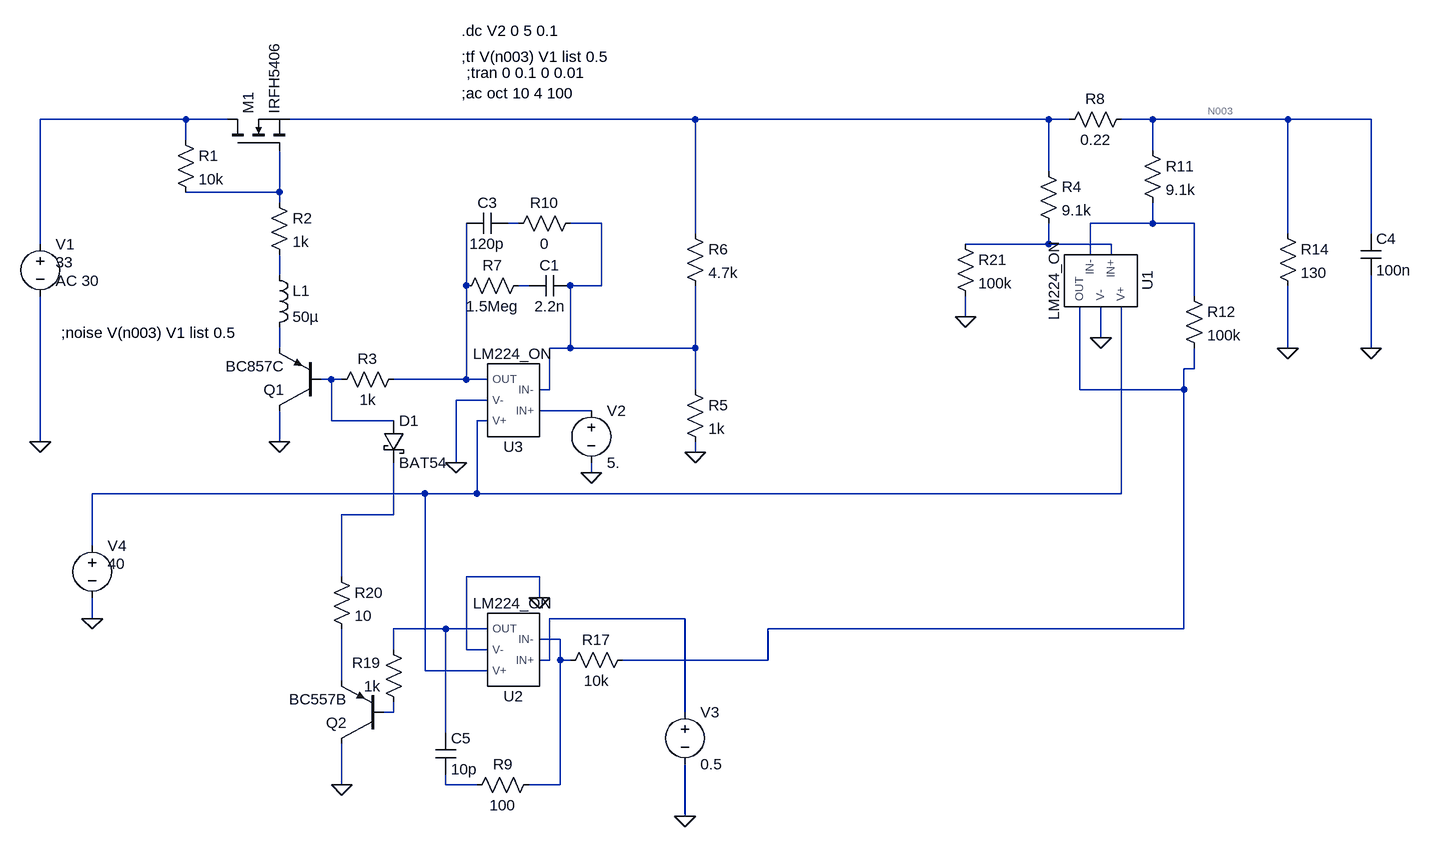
[diagram p0: schematic power_ac3.asc]
power_ac3.asc, the LTspice schematic file:
Version 4
SHEET 1 1520 1352
WIRE -608 96 -832 96
WIRE -544 96 -608 96
WIRE 176 96 -448 96
WIRE 720 96 176 96
WIRE 752 96 720 96
WIRE 880 96 832 96
WIRE 1088 96 880 96
WIRE 1216 96 1088 96
WIRE -608 128 -608 96
WIRE 880 144 880 96
WIRE 720 176 720 96
WIRE -464 208 -464 144
WIRE -464 208 -608 208
WIRE -464 224 -464 208
WIRE -96 256 -112 256
WIRE 32 256 -16 256
WIRE 880 256 880 224
WIRE 880 256 784 256
WIRE 944 256 880 256
WIRE 176 272 176 96
WIRE 1088 272 1088 96
WIRE 1216 272 1216 96
WIRE -832 288 -832 96
WIRE 720 288 720 256
WIRE 720 288 592 288
WIRE 816 288 720 288
WIRE 784 304 784 256
WIRE 816 304 816 288
WIRE -464 336 -464 304
WIRE -176 352 -176 256
WIRE -80 352 -96 352
WIRE 32 352 32 256
WIRE 32 352 -16 352
WIRE 944 368 944 256
WIRE 592 400 592 368
WIRE 800 432 800 384
WIRE -464 448 -464 416
WIRE -16 448 -16 352
WIRE -16 448 -48 448
WIRE 176 448 176 352
WIRE 176 448 -16 448
WIRE 1088 448 1088 352
WIRE 1216 448 1216 336
WIRE 944 480 944 448
WIRE 944 480 928 480
WIRE -384 496 -400 496
WIRE -368 496 -384 496
WIRE -176 496 -176 352
WIRE -176 496 -288 496
WIRE -144 496 -176 496
WIRE -48 512 -48 448
WIRE -48 512 -64 512
WIRE 176 512 176 448
WIRE 768 512 768 384
WIRE 928 512 928 480
WIRE 928 512 768 512
WIRE -144 528 -192 528
WIRE 16 544 -64 544
WIRE -384 560 -384 496
WIRE -288 560 -384 560
WIRE -144 560 -160 560
WIRE -832 592 -832 368
WIRE -464 592 -464 544
WIRE 176 608 176 592
WIRE -192 624 -192 528
WIRE 16 640 16 624
WIRE -240 672 -752 672
WIRE -160 672 -160 560
WIRE -160 672 -240 672
WIRE 832 672 832 384
WIRE 832 672 -160 672
WIRE -288 704 -288 624
WIRE -288 704 -368 704
WIRE -752 752 -752 672
WIRE -368 800 -368 704
WIRE -64 800 -176 800
WIRE -64 832 -64 800
WIRE -752 864 -752 832
WIRE 160 864 -48 864
WIRE -208 880 -288 880
WIRE -144 880 -208 880
WIRE 928 880 928 512
WIRE 928 880 288 880
WIRE -32 896 -64 896
WIRE -288 912 -288 880
WIRE -176 912 -176 800
WIRE -144 912 -176 912
WIRE -48 928 -48 864
WIRE -48 928 -64 928
WIRE -32 928 -32 896
WIRE -16 928 -32 928
WIRE 288 928 288 880
WIRE 288 928 64 928
WIRE -240 944 -240 672
WIRE -144 944 -240 944
WIRE -368 960 -368 880
WIRE -288 1008 -288 992
WIRE -288 1008 -304 1008
WIRE 160 1008 160 864
WIRE -208 1040 -208 880
WIRE -368 1120 -368 1056
WIRE -208 1120 -208 1104
WIRE -160 1120 -208 1120
WIRE -32 1120 -32 928
WIRE -32 1120 -80 1120
WIRE 160 1168 160 1088
FLAG -464 592 0
FLAG -832 592 0
FLAG 16 640 0
FLAG -192 624 0
FLAG 176 608 0
FLAG 1088 448 0
FLAG 160 1168 0
FLAG -64 832 0
FLAG -368 1120 0
FLAG 592 400 0
FLAG 1216 448 0
FLAG -752 864 0
FLAG 800 432 0
SYMBOL res -624 112 R0
SYMATTR InstName R1
SYMATTR Value 10k
SYMBOL res -480 208 R0
SYMATTR InstName R2
SYMATTR Value 1k
SYMBOL pnp -400 544 R180
SYMATTR InstName Q1
SYMATTR Value BC857C
SYMBOL res -272 480 R90
WINDOW 0 0 56 VBottom 2
WINDOW 3 32 56 VTop 2
SYMATTR InstName R3
SYMATTR Value 1k
SYMBOL voltage -832 272 R0
WINDOW 123 24 72 Left 2
WINDOW 39 0 0 Left 2
WINDOW 3 24 44 Left 2
SYMATTR Value2 AC 30
SYMATTR Value 33
SYMATTR InstName V1
SYMBOL voltage 16 528 R0
WINDOW 123 24 124 Left 2
WINDOW 39 0 0 Left 2
SYMATTR InstName V2
SYMATTR Value 5.
SYMBOL nmos -544 144 R270
SYMATTR InstName M1
SYMATTR Value IRFH5406
SYMBOL res 160 496 R0
SYMATTR InstName R5
SYMATTR Value 1k
SYMBOL res 160 256 R0
SYMATTR InstName R6
SYMATTR Value 4.7k
SYMBOL res -80 336 R90
WINDOW 0 0 56 VBottom 2
WINDOW 3 32 56 VTop 2
SYMATTR InstName R7
SYMATTR Value 1.5Meg
SYMBOL cap -16 336 R90
WINDOW 0 0 32 VBottom 2
WINDOW 3 32 32 VTop 2
SYMATTR InstName C1
SYMATTR Value 2.2n
SYMBOL res 848 80 R90
WINDOW 0 0 56 VBottom 2
WINDOW 3 32 56 VTop 2
SYMATTR InstName R8
SYMATTR Value 0.22
SYMBOL cap -112 240 R90
WINDOW 0 0 32 VBottom 2
WINDOW 3 32 32 VTop 2
SYMATTR InstName C3
SYMATTR Value 120p
SYMBOL res 0 240 R90
WINDOW 0 0 56 VBottom 2
WINDOW 3 32 56 VTop 2
SYMATTR InstName R10
SYMATTR Value 0
SYMBOL ind -480 320 R0
SYMATTR InstName L1
SYMATTR Value 50µ
SYMBOL res 704 160 R0
SYMATTR InstName R4
SYMATTR Value 9.1k
SYMBOL res 864 128 R0
SYMATTR InstName R11
SYMATTR Value 9.1k
SYMBOL res 928 352 R0
SYMATTR InstName R12
SYMATTR Value 100k
SYMBOL res 80 912 R90
WINDOW 0 0 56 VBottom 2
WINDOW 3 32 56 VTop 2
SYMATTR InstName R17
SYMATTR Value 10k
SYMBOL voltage 160 992 R0
WINDOW 123 24 124 Left 2
WINDOW 39 0 0 Left 2
SYMATTR InstName V3
SYMATTR Value 0.5
SYMBOL res -272 1008 R180
WINDOW 0 36 76 Left 2
WINDOW 3 36 40 Left 2
SYMATTR InstName R19
SYMATTR Value 1k
SYMBOL res -384 784 R0
SYMATTR InstName R20
SYMATTR Value 10
SYMBOL pnp -304 1056 R180
SYMATTR InstName Q2
SYMATTR Value BC557B
SYMBOL schottky -304 560 R0
SYMATTR InstName D1
SYMATTR Value BAT54
SYMATTR Description Diode
SYMATTR Type diode
SYMBOL res 1072 256 R0
SYMATTR InstName R14
SYMATTR Value 130
SYMATTR SpiceLine tol=1 pwr=0.1
SYMBOL res 576 272 R0
SYMATTR InstName R21
SYMATTR Value 100k
SYMBOL cap -224 1040 R0
SYMATTR InstName C5
SYMATTR Value 10p
SYMBOL cap 1200 272 R0
SYMATTR InstName C4
SYMATTR Value 100n
SYMBOL voltage -752 736 R0
WINDOW 123 24 72 Left 2
WINDOW 39 0 0 Left 2
WINDOW 3 24 44 Left 2
SYMATTR Value 40
SYMATTR InstName V4
SYMBOL AutoGenerated\\LM224_ON -96 528 R180
SYMATTR InstName U3
SYMBOL AutoGenerated\\LM224_ON 800 336 R90
SYMATTR InstName U1
SYMBOL AutoGenerated\\LM224_ON -96 912 R180
SYMATTR InstName U2
SYMBOL res -64 1104 R90
WINDOW 0 0 56 VBottom 2
WINDOW 3 32 56 VTop 2
SYMATTR InstName R9
SYMATTR Value 100
TEXT -184 -40 Left 2 !.dc V2 0 5 0.1
TEXT -184 56 Left 2 !;ac oct 10 4 100
TEXT -176 24 Left 2 !;tran 0 0.1 0 0.01
TEXT -184 0 Left 2 !;tf V(n003) V1 list 0.5
TEXT -800 424 Left 2 !;noise V(n003) V1 list 0.5

The netlist it stands for:
* power_ac3.asc
R1 N001 N004 10k
R2 N004 N009 1k
Q1 0 N014 N012 0 BC857C
R3 N010 N014 1k
V1 N001 0 33 AC 30
V2 N015 0 5.
M1 N001 N004 N002 N002 IRFH5406
R5 N006 0 1k
R6 N002 N006 4.7k
R7 N011 N010 1.5Meg
C1 N006 N011 2.2n
R8 N003 N002 0.22
C3 N005 N010 120p
R10 N006 N005 0
L1 N009 N012 50µ
R4 N002 N008 9.1k
R11 N003 N007 9.1k
R12 N007 N013 100k
R17 N013 N020 10k
V3 N018 0 0.5
R19 N022 N019 1k
R20 N017 N021 10
Q2 0 N022 N021 0 BC557B
D1 N014 N017 BAT54
R14 N003 0 130 tol=1 pwr=0.1
R21 N008 0 100k
C5 N019 N023 10p
C4 N003 0 100n
V4 N016 0 40
XU3 N015 N006 N016 0 N010 LM224_ON  ; pins IN+ IN- V+ V- OUT
XU1 N008 N007 N016 0 N013 LM224_ON  ; pins IN+ IN- V+ V- OUT
XU2 N018 N020 N016 0 N019 LM224_ON  ; pins IN+ IN- V+ V- OUT
R9 N020 N023 100
.model D D
.lib standard.dio
.model NPN NPN
.model PNP PNP
.lib standard.bjt
.model NMOS NMOS
.model PMOS PMOS
.lib standard.mos
.dc V2 0 5 0.1
;ac oct 10 4 100
;tran 0 0.1 0 0.01
;tf V(n003) V1 list 0.5
;noise V(n003) V1 list 0.5
.lib C:\Users\uidl9506\Downloads\LM224 PSPICE MODEL.MOD
.backanno
.end